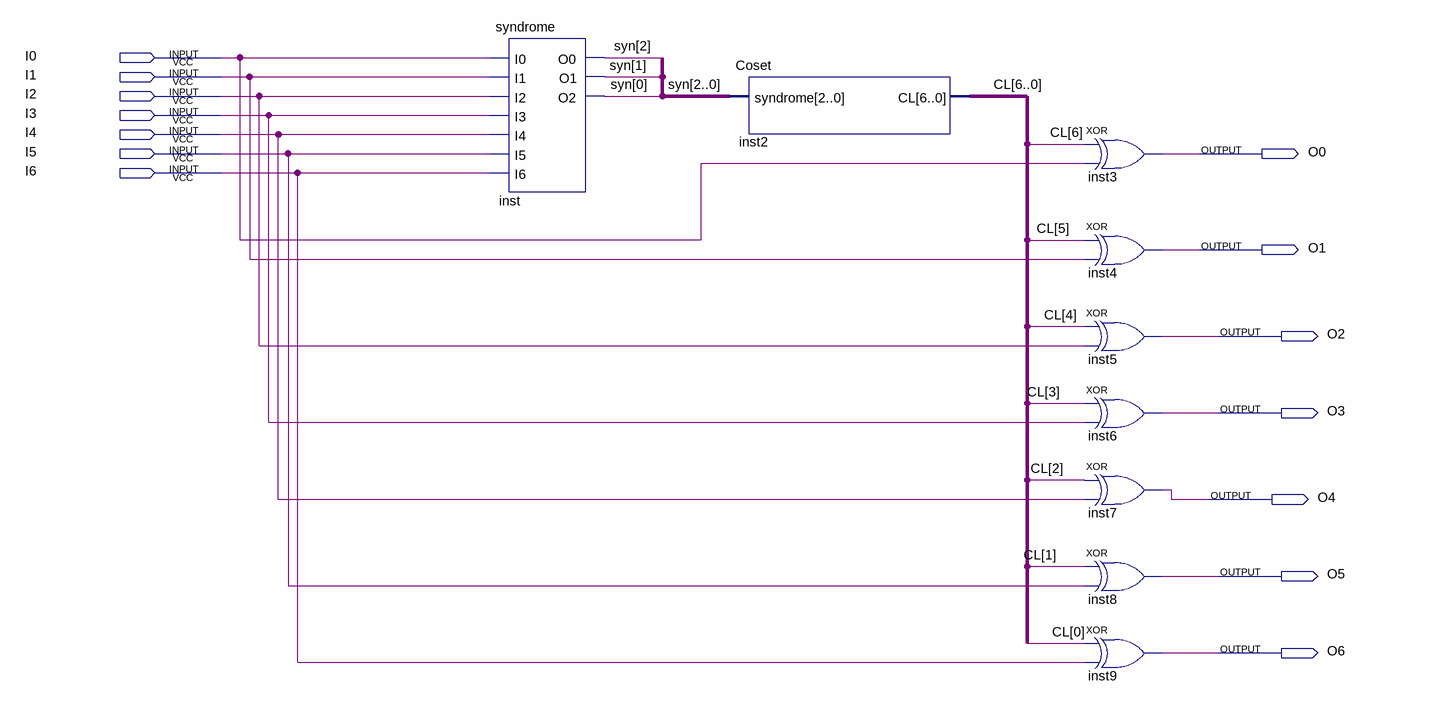
[diagram p0: schematic sheet]
// Quartus schematic CorrectCode.bdf as structural Verilog: 9 symbols, 14 pins
module CorrectCode (
  input  I0,
  input  I1,
  input  I2,
  input  I3,
  input  I4,
  input  I5,
  input  I6,
  output O0,
  output O1,
  output O2,
  output O3,
  output O4,
  output O5,
  output O6
);

  wire [2:0] syn;
  wire [6:0] CL;

  syndrome inst (.I0(I0), .I1(I1), .I2(I2), .I3(I3), .I4(I4), .I5(I5), .I6(I6), .O0(syn[2]), .O1(syn[1]), .O2(syn[0]));
  Coset inst2 (.syndrome(syn), .CL(CL));
  xor inst3 (O0, CL[6], I0);
  xor inst4 (O1, CL[5], I1);
  xor inst5 (O2, CL[4], I2);
  xor inst6 (O3, CL[3], I3);
  xor inst7 (O4, CL[2], I4);
  xor inst8 (O5, CL[1], I5);
  xor inst9 (O6, CL[0], I6);
endmodule
